# EAGLE design CIRCUITV05 (EAGLE 9.6.2)
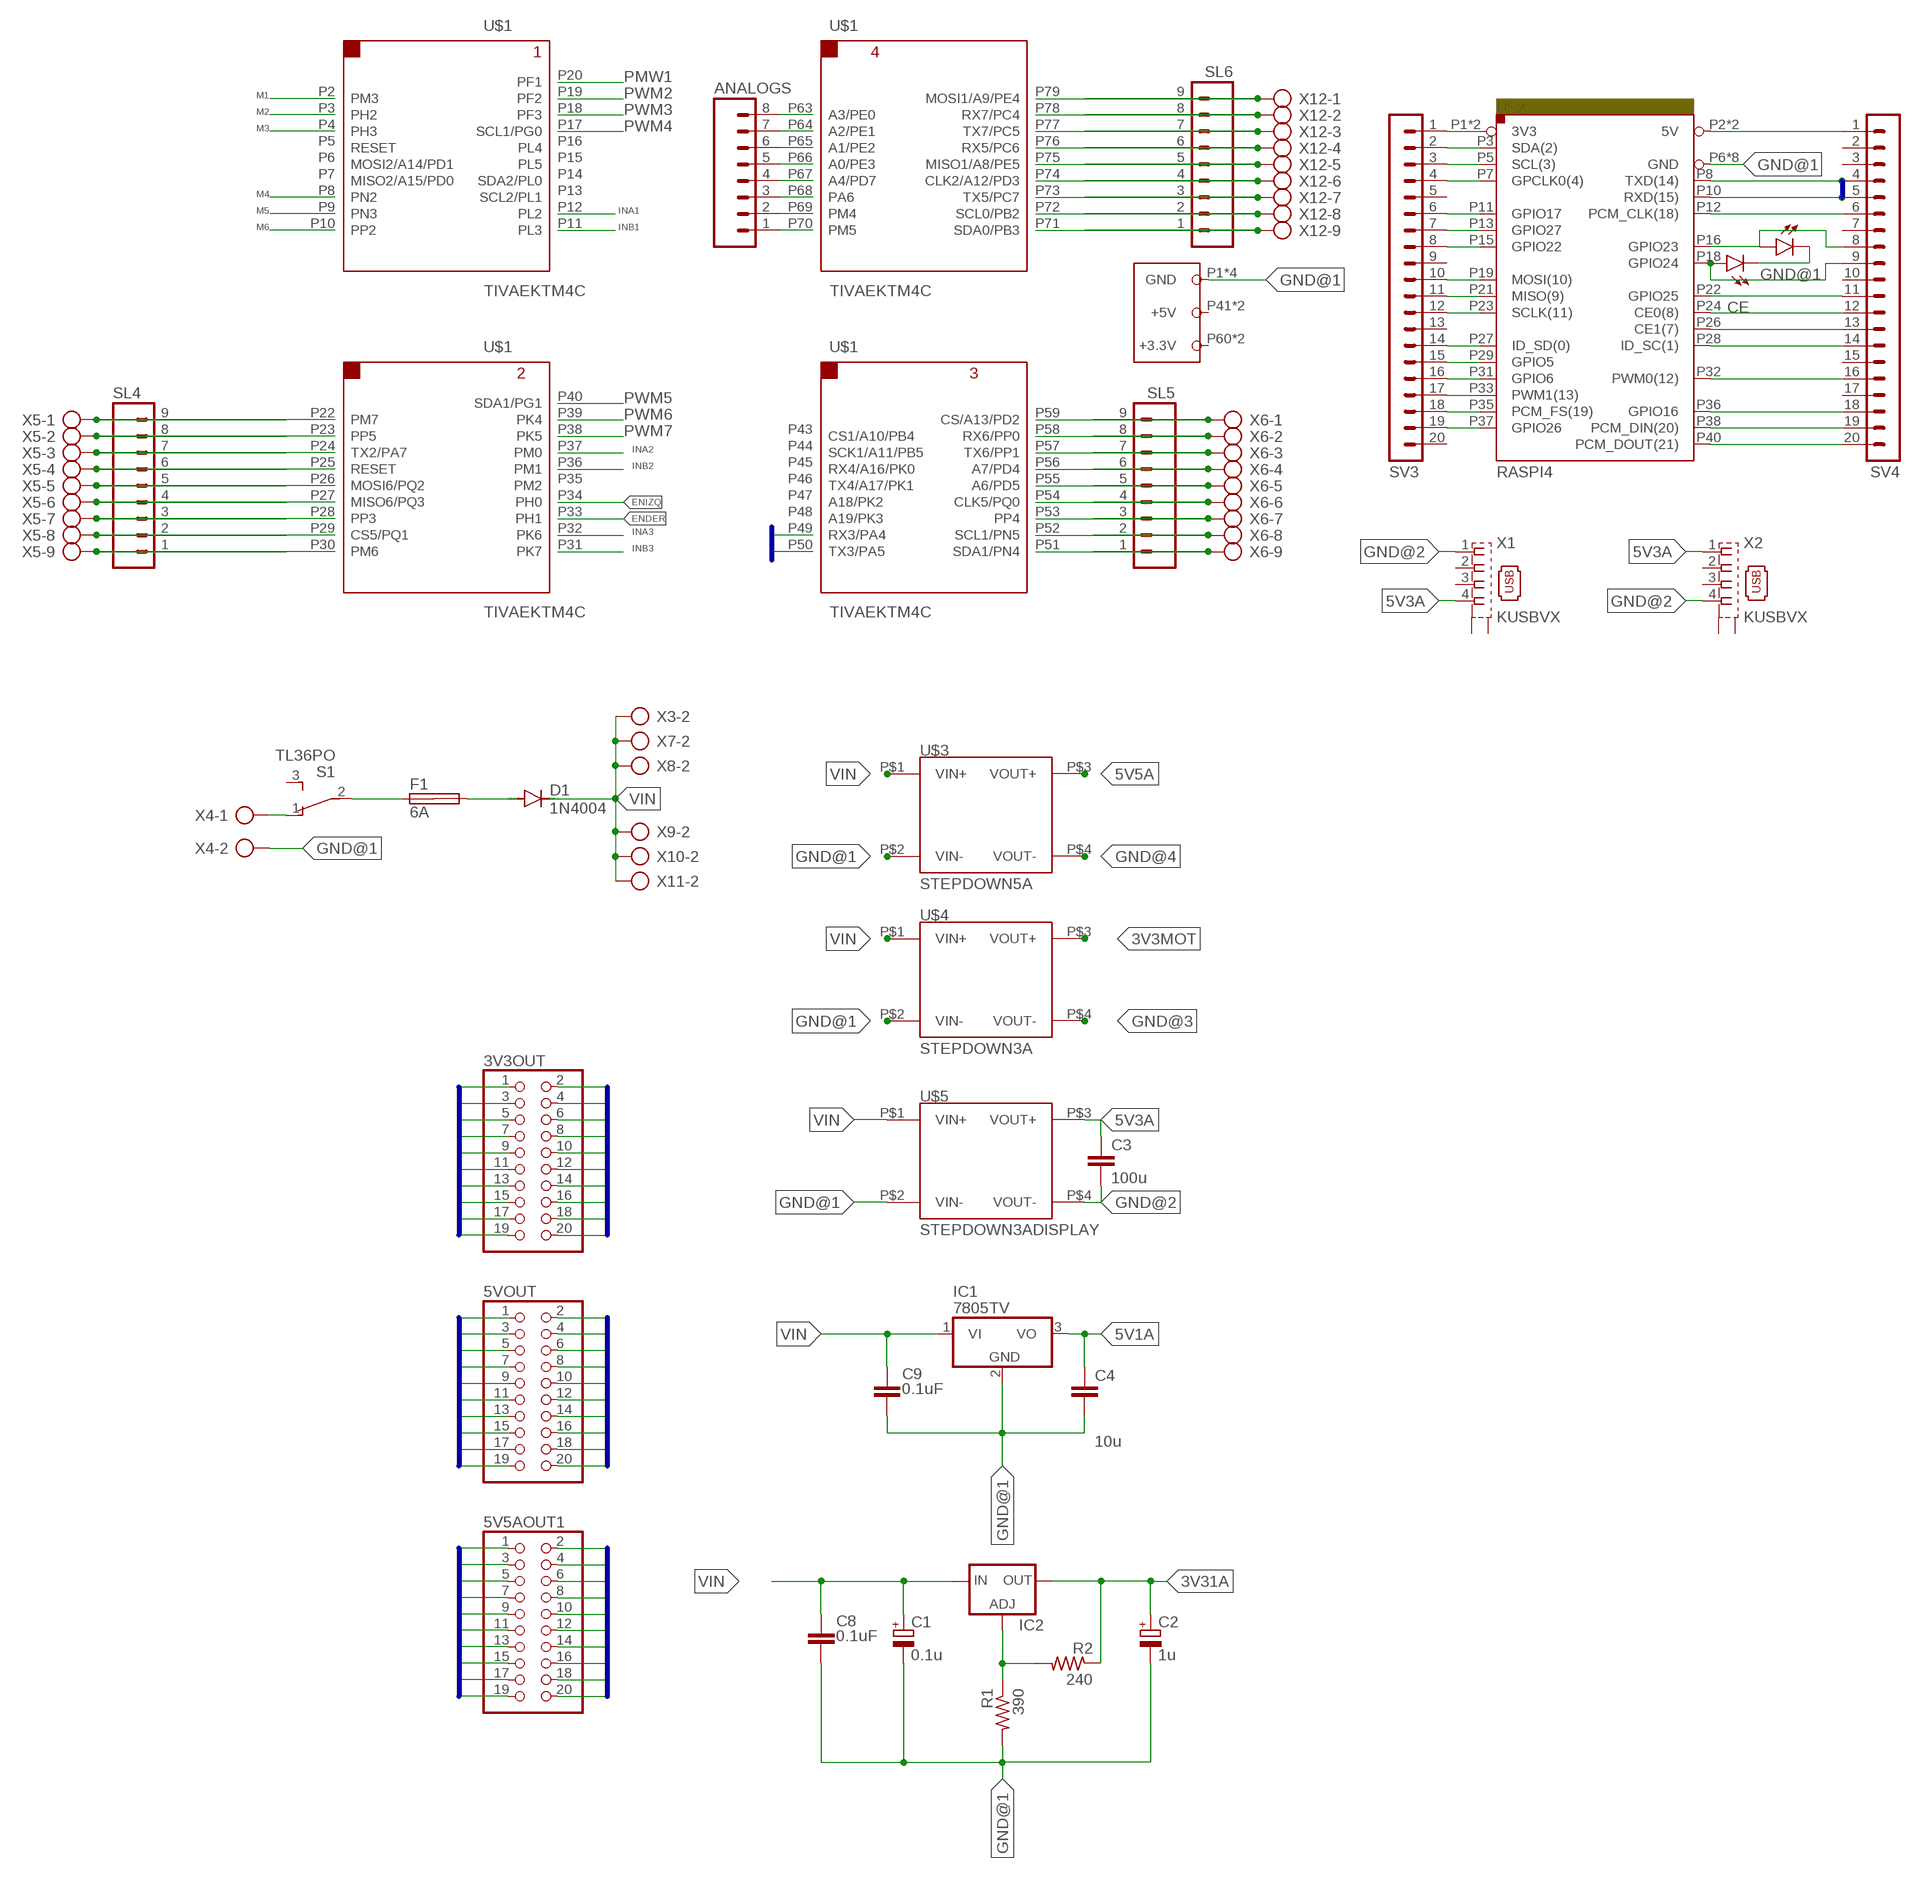
[diagram p0: schematic, sheet 1, part 1 of 2]
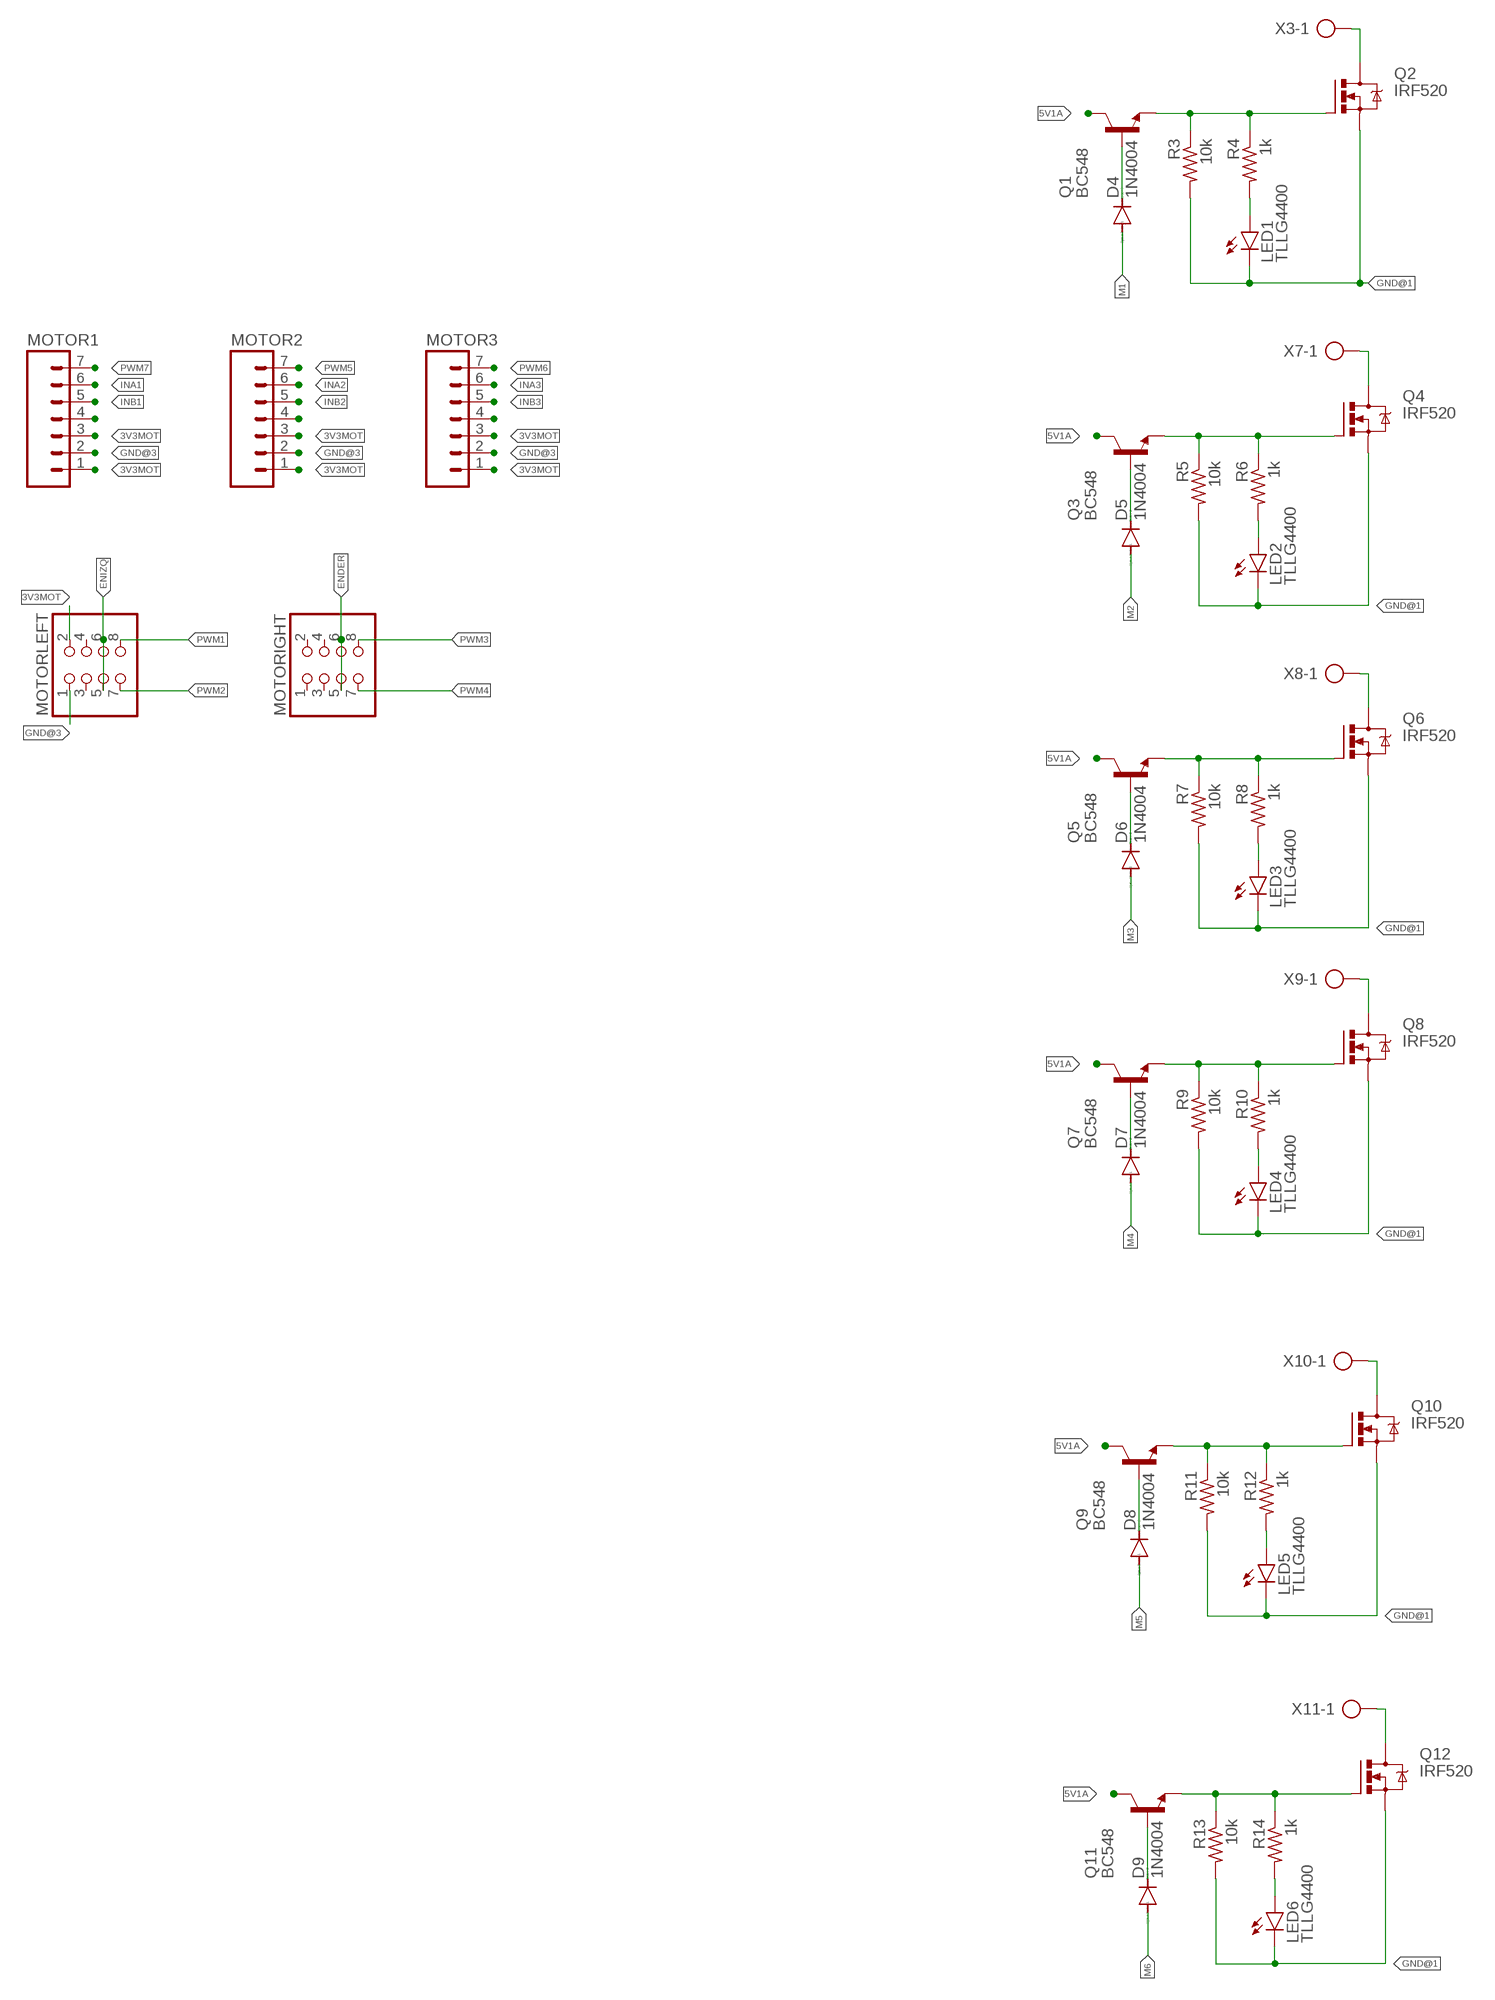
[diagram p1: schematic, sheet 1, part 2 of 2]

## Parts
3V3OUT  PINHD-2X10  [2X10]
5V5AOUT1  PINHD-2X10  [2X10]
5VOUT  PINHD-2X10  [2X10]
ANALOGS  MA08  [08PA]
C1  0.1u  CPOL-EUE5-10.5  [E5-10,5]
C2  1u  CPOL-EUE5-10.5  [E5-10,5]
C3  100u  C-EU025-024X044  [C025-024X044]
C4  10u  C-EU025-024X044  [C025-024X044]
C8  0.1uF  C-EU075-052X106  [C075-052X106]
C9  0.1uF  C-EU075-052X106  [C075-052X106]
D1  1N4004  [DO41-10]
D2  SFH482  [SFH482]
D3  SFH482  [SFH482]
D4  1N4004  [DO41-10]
D5  1N4004  [DO41-10]
D6  1N4004  [DO41-10]
D7  1N4004  [DO41-10]
D8  1N4004  [DO41-10]
D9  1N4004  [DO41-10]
F1  6A  SHK20L  [SHK20L]
IC1  7805TV  [TO220V]
IC2  LM317TL  [317TL]
LED1  TLLG4400  [LED3MM]
LED2  TLLG4400  [LED3MM]
LED3  TLLG4400  [LED3MM]
LED4  TLLG4400  [LED3MM]
LED5  TLLG4400  [LED3MM]
LED6  TLLG4400  [LED3MM]
MOTOR1  MA07  [07PA]
MOTOR2  MA07  [07PA]
MOTOR3  MA07  [07PA]
MOTORIGHT  PINHD-2X4  [2X04]
MOTORLEFT  PINHD-2X4  [2X04]
Q1  BC548  [TO92-EBC]
Q2  IRF520  [TO220BV]
Q3  BC548  [TO92-EBC]
Q4  IRF520  [TO220BV]
Q5  BC548  [TO92-EBC]
Q6  IRF520  [TO220BV]
Q7  BC548  [TO92-EBC]
Q8  IRF520  [TO220BV]
Q9  BC548  [TO92-EBC]
Q10  IRF520  [TO220BV]
Q11  BC548  [TO92-EBC]
Q12  IRF520  [TO220BV]
R1  390  R-US_0207/10  [0207/10]
R2  240  R-US_0207/10  [0207/10]
R3  10k  R-US_0207/10  [0207/10]
R4  1k  R-US_0207/10  [0207/10]
R5  10k  R-US_0207/10  [0207/10]
R6  1k  R-US_0207/10  [0207/10]
R7  10k  R-US_0207/10  [0207/10]
R8  1k  R-US_0207/10  [0207/10]
R9  10k  R-US_0207/10  [0207/10]
R10  1k  R-US_0207/10  [0207/10]
R11  10k  R-US_0207/10  [0207/10]
R12  1k  R-US_0207/10  [0207/10]
R13  10k  R-US_0207/10  [0207/10]
R14  1k  R-US_0207/10  [0207/10]
S1  TL36PO  [TL3XPO]
SL4  M09  [09P]
SL5  M09  [09P]
SL6  M09  [09P]
SV3  MA20-1  [MA20-1]
SV4  MA20-1  [MA20-1]
U$1  TIVAEKTM4C  [TIVAPINESPCB]
U$2  RASPI4  [CONN2-SIL40]
U$3  STEPDOWN5A  [REGULADORSTEP-DOWN5ACURRENT]
U$4  STEPDOWN3A  [REGULADORSTEP-DOWN3A]
U$5  STEPDOWN3ADISPLAY  [REGULADORWITHDISPLAY]
X1  KUSBVX  [KUSBVX]
X2  KUSBVX  [KUSBVX]
X3  AK300/2  [AK300/2]
X4  AK300/2  [AK300/2]
X5  AK300/9  [AK300/9]
X6  AK300/9  [AK300/9]
X7  AK300/2  [AK300/2]
X8  AK300/2  [AK300/2]
X9  AK300/2  [AK300/2]
X10  AK300/2  [AK300/2]
X11  AK300/2  [AK300/2]
X12  AK300/9  [AK300/9]

## Nets
3V3MOT [outsVoltaje]: MOTOR1.1 MOTOR1.3 MOTOR2.1 MOTOR2.3 MOTOR3.1 MOTOR3.3 MOTORLEFT.2 U$4.P$3(VOUT+)
3V31A [outsVoltaje]: 3V3OUT.1 3V3OUT.3 3V3OUT.5 3V3OUT.7 3V3OUT.9 3V3OUT.11 3V3OUT.13 3V3OUT.15 3V3OUT.17 3V3OUT.19 C2.+ IC2.2(OUT) R2.1
5V1A [outsVoltaje]: 5VOUT.1 5VOUT.3 5VOUT.5 5VOUT.7 5VOUT.9 5VOUT.11 5VOUT.13 5VOUT.15 5VOUT.17 5VOUT.19 C4.1 IC1.3(VO) Q1.C Q3.C Q5.C Q7.C Q9.C Q11.C
5V3A [outsVoltaje]: C3.1 U$5.P$3(VOUT+) X1.4 X2.1
5V5A [outsVoltaje]: 5V5AOUT1.1 5V5AOUT1.3 5V5AOUT1.5 5V5AOUT1.7 5V5AOUT1.9 5V5AOUT1.11 5V5AOUT1.13 5V5AOUT1.15 5V5AOUT1.17 5V5AOUT1.19 U$3.P$3(VOUT+)
CE: SV4.12 U$2.P24(CE0(8))
CLK [signals]: SV3.12 U$2.P23(SCLK(11))
ENDER [signals]: MOTORIGHT.5 MOTORIGHT.6 U$1.P33(PH1)
ENIZQ [signals]: MOTORLEFT.5 MOTORLEFT.6 U$1.P34(PH0)
GND@1 [gnds]: 3V3OUT.2 3V3OUT.4 3V3OUT.6 3V3OUT.8 3V3OUT.10 3V3OUT.12 3V3OUT.14 3V3OUT.16 3V3OUT.18 3V3OUT.20 5V5AOUT1.2 5V5AOUT1.4 5V5AOUT1.6 5V5AOUT1.8 5V5AOUT1.10 5V5AOUT1.12 5V5AOUT1.14 5V5AOUT1.16 5V5AOUT1.18 5V5AOUT1.20 5VOUT.2 5VOUT.4 5VOUT.6 5VOUT.8 5VOUT.10 5VOUT.12 5VOUT.14 5VOUT.16 5VOUT.18 5VOUT.20 C4.2 C9.2 D2.K(C) D3.K(C) IC1.2(GND) LED1.K(C) LED2.K(C) LED3.K(C) LED4.K(C) LED5.K(C) LED6.K(C) Q2.S Q4.S Q6.S Q8.S Q10.S Q12.S R3.2 R5.2 R7.2 R9.2 R11.2 R13.2 U$1.P1(GND) U$1.P21(GND) U$1.P42(GND) U$1.P62(GND) U$3.P$2(VIN-) U$4.P$2(VIN-) U$5.P$2(VIN-) X4.2
GND@2 [gnds]: C3.2 U$5.P$4(VOUT-) X1.1 X2.4
GND@3 [gnds]: MOTOR1.2 MOTOR2.2 MOTOR3.2 MOTORLEFT.1 U$4.P$4(VOUT-)
GND@4 [gnds]: U$3.P$4(VOUT-)
INA1 [signals]: MOTOR1.6 U$1.P12(PL2)
INA2 [signals]: MOTOR2.6 U$1.P37(PM0)
INA3 [signals]: MOTOR3.6 U$1.P32(PK6)
INB1 [signals]: MOTOR1.5 U$1.P11(PL3)
INB2 [signals]: MOTOR2.5 U$1.P36(PM1)
INB3 [signals]: MOTOR3.5 U$1.P31(PK7)
M1 [signals]: D4.A U$1.P2(PM3)
M2 [signals]: D5.A U$1.P3(PH2)
M3 [signals]: D6.A U$1.P4(PH3)
M4 [signals]: D7.A U$1.P8(PN2)
M5 [signals]: D8.A U$1.P9(PN3)
M6 [signals]: D9.A U$1.P10(PP2)
MISO [signals]: SV3.10 SV3.11 U$2.P19(MOSI(10)) U$2.P21(MISO(9))
N$1: S1.1(O) X4.1
N$2: F1.1A S1.2(P)
N$3: IC2.1(ADJ) R1.1 R2.2
N$4: SV3.1 U$2.P1(3V3) U$2.P17(3V3)
N$5: C1.- C2.- C8.2 R1.2
N$6: C1.+ C8.1 IC2.3(IN)
N$7: U$2.P6(GND) U$2.P9(GND) U$2.P14(GND) U$2.P20(GND) U$2.P25(GND) U$2.P30(GND) U$2.P34(GND) U$2.P39(GND)
N$8: SV3.2 U$2.P3(SDA(2))
N$9: SV3.3 U$2.P5(SCL(3))
N$10: SV3.4 U$2.P7(GPCLK0(4))
N$11: SV3.6 U$2.P11(GPIO17)
N$12: SV3.7 U$2.P13(GPIO27)
N$13: SV3.8 U$2.P15(GPIO22)
N$14: D1.A F1.2A
N$15: MOTOR2.4
N$16: MOTOR3.4
N$17: SV3.14 U$2.P27(ID_SD(0))
N$18: SV3.15 U$2.P29(GPIO5)
N$19: SV3.16 U$2.P31(GPIO6)
N$20: SV3.17 U$2.P33(PWM1(13))
N$21: SV3.18 U$2.P35(PCM_FS(19))
N$22: SV3.19 U$2.P37(GPIO26)
N$23: SV4.1 U$2.P2(5V) U$2.P4(5V)
N$24: D4.C Q1.B
N$25: MOTOR1.4
N$26: SV4.6 U$2.P12(PCM_CLK(18))
N$27: D3.A SV4.9 U$2.P18(GPIO24)
N$28: Q1.E Q2.G R3.1 R4.1
N$29: SV4.11 U$2.P22(GPIO25)
N$30: LED1.A R4.2
N$31 [signals]: D5.C Q3.B
N$32: SV4.13 U$2.P26(CE1(7))
N$33: SV4.14 U$2.P28(ID_SC(1))
N$34: SV4.16 U$2.P32(PWM0(12))
N$35: SV4.18 U$2.P36(GPIO16)
N$36: SV4.19 U$2.P38(PCM_DIN(20))
N$37: SV4.20 U$2.P40(PCM_DOUT(21))
N$38: D2.A SV4.8 U$2.P16(GPIO23)
N$39: Q2.D X3.1
N$40: SL4.9 U$1.P22(PM7) X5.1
N$41: Q3.E Q4.G R5.1 R6.1
N$42: LED2.A R6.2
N$43 [signals]: Q4.D X7.1
N$44: D6.C Q5.B
N$45: Q5.E Q6.G R7.1 R8.1
N$46: LED3.A R8.2
N$47: Q6.D X8.1
N$48: D7.C Q7.B
N$49: Q7.E Q8.G R9.1 R10.1
N$50: LED4.A R10.2
N$51: Q8.D X9.1
N$52: D8.C Q9.B
N$53: Q9.E Q10.G R11.1 R12.1
N$54: LED5.A R12.2
N$55: Q10.D X10.1
N$56: D9.C Q11.B
N$57: Q11.E Q12.G R13.1 R14.1
N$58: LED6.A R14.2
N$59: Q12.D X11.1
N$60: SL4.8 U$1.P23(PP5) X5.2
N$61: SL4.7 U$1.P24(TX2/PA7) X5.3
N$62: SL4.6 U$1.P25(RESET) X5.4
N$63: SL4.5 U$1.P26(MOSI6/PQ2) X5.5
N$64: SL4.4 U$1.P27(MISO6/PQ3) X5.6
N$65: SL4.3 U$1.P28(PP3) X5.7
N$66: SL4.2 U$1.P29(CS5/PQ1) X5.8
N$67: SL4.1 U$1.P30(PM6) X5.9
N$68: SL5.9 U$1.P59(CS/A13/PD2) X6.1
N$69: SL5.8 U$1.P58(RX6/PP0) X6.2
N$70: SL5.7 U$1.P57(TX6/PP1) X6.3
N$71: SL5.6 U$1.P56(A7/PD4) X6.4
N$72: SL5.5 U$1.P55(A6/PD5) X6.5
N$73: SL5.4 U$1.P54(CLK5/PQ0) X6.6
N$74: SL5.3 U$1.P53(PP4) X6.7
N$75: SL5.2 U$1.P52(SCL1/PN5) X6.8
N$76: SL5.1 U$1.P51(SDA1/PN4) X6.9
N$77: SL6.1 U$1.P71(SDA0/PB3) X12.9
N$78: SL6.2 U$1.P72(SCL0/PB2) X12.8
N$79: SL6.3 U$1.P73(TX5/PC7) X12.7
N$80: SL6.4 U$1.P74(CLK2/A12/PD3) X12.6
N$81: SL6.5 U$1.P75(MISO1/A8/PE5) X12.5
N$82: SL6.6 U$1.P76(RX5/PC6) X12.4
N$83: SL6.7 U$1.P77(TX7/PC5) X12.3
N$84: SL6.8 U$1.P78(RX7/PC4) X12.2
N$85: SL6.9 U$1.P79(MOSI1/A9/PE4) X12.1
N$86: ANALOGS.8 U$1.P63(A3/PE0)
N$87: ANALOGS.7 U$1.P64(A2/PE1)
N$88: ANALOGS.6 U$1.P65(A1/PE2)
N$89: ANALOGS.5 U$1.P66(A0/PE3)
N$90: ANALOGS.4 U$1.P67(A4/PD7)
N$91: ANALOGS.3 U$1.P68(PA6)
N$92: ANALOGS.2 U$1.P69(PM4)
N$93: ANALOGS.1 U$1.P70(PM5)
PMW1 [signals]: U$1.P20(PF1)
PWM1: MOTORLEFT.8
PWM2 [signals]: MOTORLEFT.7 U$1.P19(PF2)
PWM3 [signals]: MOTORIGHT.8 U$1.P18(PF3)
PWM4 [signals]: MOTORIGHT.7 U$1.P17(SCL1/PG0)
PWM5 [signals]: MOTOR2.7 U$1.P40(SDA1/PG1)
PWM6 [signals]: MOTOR3.7 U$1.P39(PK4)
PWM7: MOTOR1.7 U$1.P38(PK5)
RX [signals]: SV4.5 U$2.P10(RXD(15))
RX3 [signals]: U$1.P49(RX3/PA4)
TX [signals]: SV4.4 U$2.P8(TXD(14))
TX3 [signals]: U$1.P50(TX3/PA5)
VIN [VInbat]: C9.1 D1.C IC1.1(VI) U$3.P$1(VIN+) U$4.P$1(VIN+) U$5.P$1(VIN+) X3.2 X7.2 X8.2 X9.2 X10.2 X11.2
Unconnected: F1.1B F1.2B MOTORIGHT.1 MOTORIGHT.2 MOTORIGHT.3 MOTORIGHT.4 MOTORLEFT.3 MOTORLEFT.4 S1.3(S) SV3.5 SV3.9 SV3.13 SV3.20 SV4.2 SV4.3 SV4.7 SV4.10 SV4.15 SV4.17 U$1.P5(RESET) U$1.P6(MOSI2/A14/PD1) U$1.P7(MISO2/A15/PD0) U$1.P13(SCL2/PL1) U$1.P14(SDA2/PL0) U$1.P15(PL5) U$1.P16(PL4) U$1.P35(PM2) U$1.P41(+5V) U$1.P43(CS1/A10/PB4) U$1.P44(SCK1/A11/PB5) U$1.P45(RX4/A16/PK0) U$1.P46(TX4/A17/PK1) U$1.P47(A18/PK2) U$1.P48(A19/PK3) U$1.P60(+3.3V) U$1.P61(+5V) U$1.P80(+3.3V) X1.2 X1.3 X1.M1(S1) X1.M2(S2) X2.2 X2.3 X2.M1(S1) X2.M2(S2)

## Buses
5V1A:5V1A
GNDS:GND@1
3V31AS:3V31A
UARTIVA:RX3,TX3
UARTRASP:RX,TX
5V5A

## Library data of the parts
3V3OUT 5V5AOUT1 5VOUT = pinhead:PINHD-2X10: PIN HEADER
ANALOGS = con-amp-quick:MA08: AMP QUICK CONNECTOR; OC_FARNELL: unknown; OC_NEWARK: unknown
C1 C2 = rcl:CPOL-EU: POLARIZED CAPACITOR, European symbol; SPICEPREFIX: C
C3 C4 C8 C9 = rcl:C-EU: CAPACITOR, European symbol; SPICEPREFIX: C
D1 D4-D9 = diode:1N4004: DIODE general purpose rectifier, 1 A
D2 D3 = led:SFH482: IR LED infrared emitting diode, Infineon
F1 = fuse:SHK20L: FUSE HOLDER 5 x 20 mm, SH contact, SHH1 Schukat, E1073 Buerklin; OC_FARNELL: unknown; OC_NEWARK: unknown
IC1 = linear:78*: Positive VOLTAGE REGULATOR Source: http://cache.national.com/ds/LM/LM78L05.pdf http://www.fairchildsemi.com/ds/LM/LM7805.pdf
IC2 = v-reg:LM317TL: VOLTAGE REGULATOR
LED1-LED6 = led:TLLG4400: Low Current (2mA) LED 3 mm Tinted Diffused Package color GREEN Source: Data sheet <http://www.farnell.com/datasheets/391098.pdf>; MF: VISHAY SEMICONDUCTOR; OC_FARNELL: 1612435
MOTOR1-MOTOR3 = con-amp-quick:MA07: AMP QUICK CONNECTOR; OC_FARNELL: unknown; OC_NEWARK: unknown
MOTORIGHT MOTORLEFT = pinhead:PINHD-2X4: PIN HEADER
Q1 Q3 Q5 Q7 Q9 Q11 = transistor-npn:BC548*: NPN Transistor
Q2 Q4 Q6 Q8 Q10 Q12 = transistor-power:IRF520: HEXFET Power MOSFET
R1-R14 = rcl:R-US_: RESISTOR, American symbol; SPICEPREFIX: R
S1 = switch:TL36PO: TINY SWITCH ON - ON Source: http://www2.produktinfo.conrad.com/datenblaetter/700000-724999/705152-da-01-de-Subminiaturschalter_TL_36YO.pdf
SL4-SL6 = con-amp-quick:M09: AMP QUICK CONNECTOR; OC_FARNELL: unknown; OC_NEWARK: unknown
SV3 SV4 = con-lstb:MA20-1: PIN HEADER; OC_FARNELL: unknown; OC_NEWARK: unknown
U$1 = TivaConnector:TIVAEKTM4C
U$2 = RaspConnector:RASPI4
U$3 = ReguladoresStep:STEPDOWN5A
U$4 = ReguladoresStep:STEPDOWN3A
U$5 = ReguladoresStep:STEPDOWN3ADISPLAY
X1 X2 = con-kycon:KUSBVX: Vertical,Top Entry Universal Serial Bus Connector KUSBVX Series Source: KYCON Sibalco USB vertical socket KUSBV.pdf
X3 X4 X7-X11 = con-ptr500:AK300/2: CONNECTOR; OC_FARNELL: unknown; OC_NEWARK: unknown
X5 X6 X12 = con-ptr500:AK300/9: CONNECTOR; OC_FARNELL: unknown; OC_NEWARK: unknown

## Net classes
0 default: width 1.016 mm, drill 2.032 mm, clearance 0.508 mm
3 VInbat: width 2.032 mm, drill 2.032 mm, clearance 0.508 mm
5 outsVoltaje: width 1.524 mm, drill 2.032 mm, clearance 0.508 mm
6 signals: width 1.016 mm, drill 2.032 mm, clearance 0.508 mm
7 gnds: width 0.762 mm, drill 2.032 mm, clearance 0.508 mm

## Board
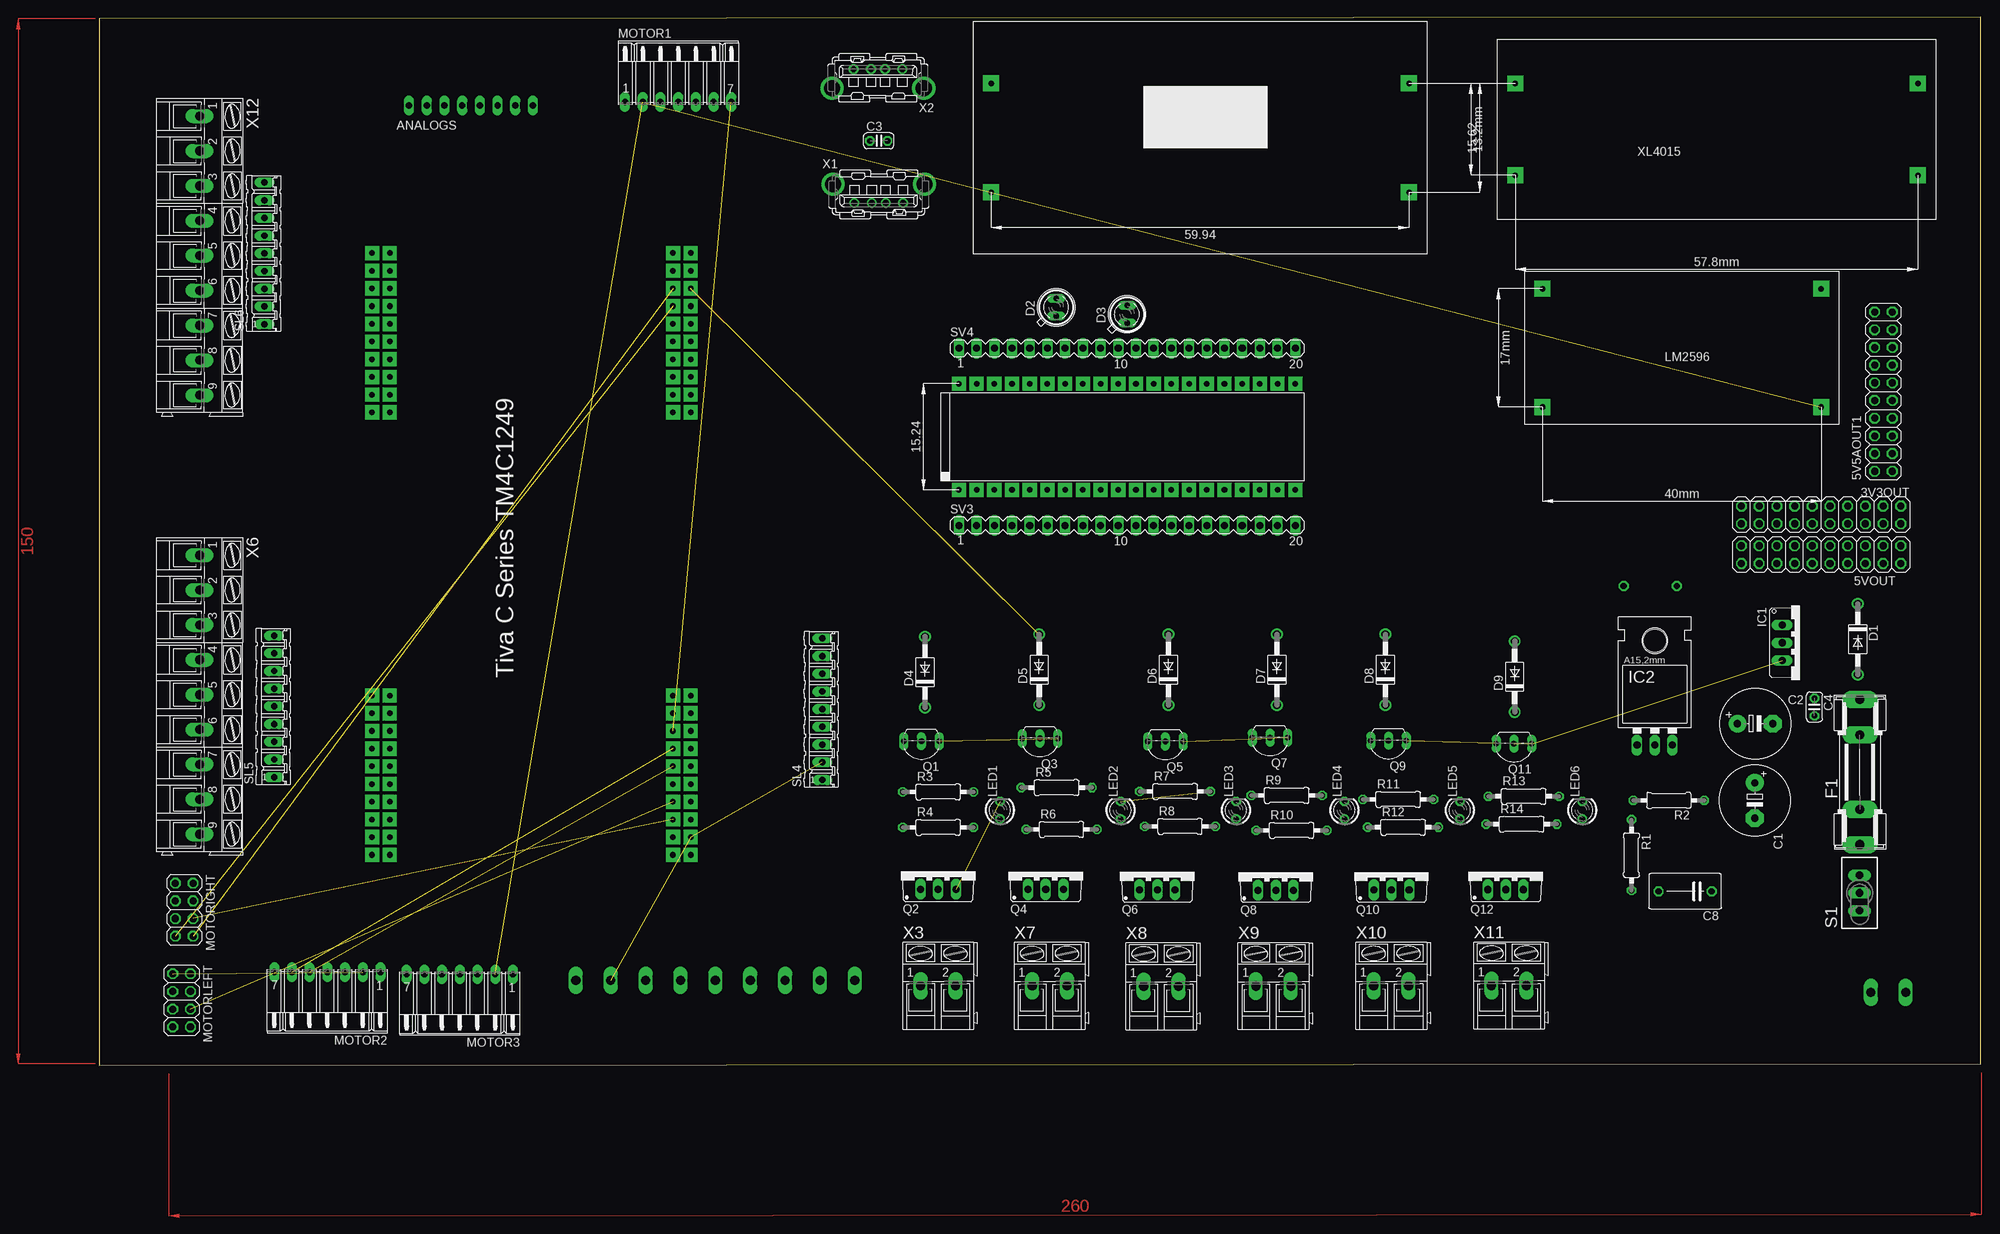
[diagram p2: board, top side]
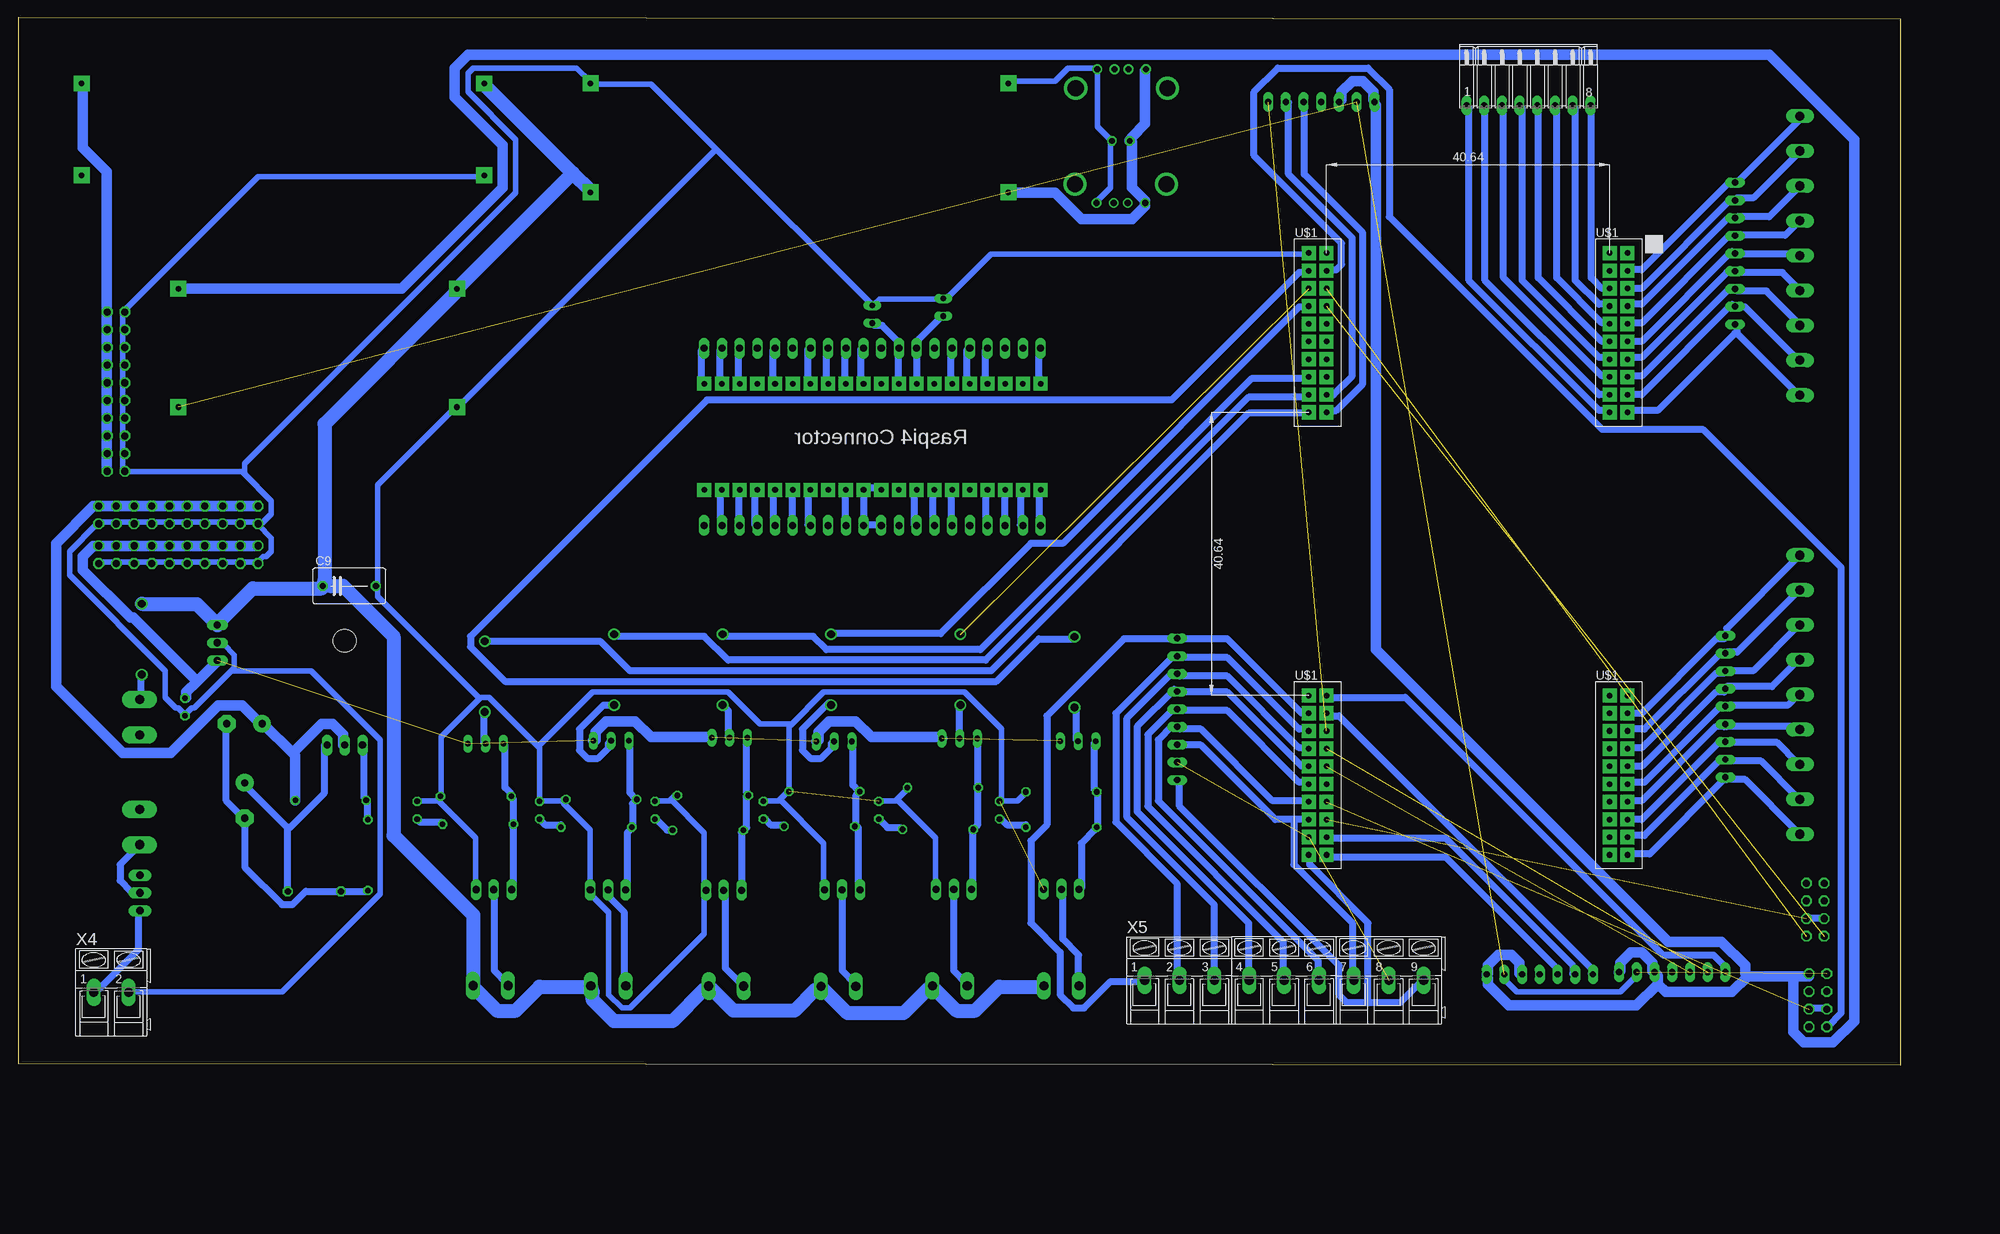
[diagram p3: board, bottom side, seen from below]

Size 269.98 x 150.34 mm. Coordinates in mm from the lower left corner, seen from the top.
Outline: 0,0 269.98,0.2 269.98,150.34 0,150.14 0,0
Copper layers (1*16): Top 0.035mm / dielectric 1.5mm / Bottom 0.035mm
Design rules "default": minimum track width 6mil, minimum drill 0.35mm, track to track 6mil, track to pad 6mil, pad to pad 6mil, via to via 6mil, smd to smd 6mil, copper to edge 40mil, drill to drill 6mil, minimum pad ring 10mil, minimum via ring 8mil, stop-mask expansion 4mil, vias tented up to drill 0mil, thermal gap 10mil

### Footprints (pad centres in the part's own frame; a part is rotated, then mirrored left to right if it is on the bottom)
2X10 = drill 1.016 octagon: 1 -11.43,-1.27; 2 -11.43,1.27; 3 -8.89,-1.27; 4 -8.89,1.27; 5 -6.35,-1.27; 6 -6.35,1.27; 7 -3.81,-1.27; 8 -3.81,1.27; 9 -1.27,-1.27; 10 -1.27,1.27; 11 1.27,-1.27; 12 1.27,1.27; 13 3.81,-1.27; 14 3.81,1.27; 15 6.35,-1.27; 16 6.35,1.27; 17 8.89,-1.27; 18 8.89,1.27; 19 11.43,-1.27; 20 11.43,1.27
08PA = drill 0.914 long: 1 -8.89,0; 2 -6.35,0; 3 -3.81,0; 4 -1.27,0; 5 1.27,0; 6 3.81,0; 7 6.35,0; 8 8.89,0
E5-10,5 = drill 1.016 pad 2.54: + -2.54,0 | drill 1.016 pad 2.54 octagon: - 2.54,0
C025-024X044 = drill 0.813 octagon: 1 -1.27,0; 2 1.27,0
C075-052X106 = drill 0.914 octagon: 1 -3.81,0; 2 3.81,0
DO41-10 = drill 1.118: A 5.08,0; C -5.08,0
SFH482 = drill 0.813 long: A -1.27,0; K 1.27,0
SHK20L = drill 1.321 pad 2.54 long: 1A -10.414,0; 1B -5.334,0; 2A 10.414,0; 2B 5.334,0
TO220V = drill 1.016 long: 1 -2.54,-2.54; 2 0,-2.54; 3 2.54,-2.54
317TL = drill 1.016 long: 1 -2.54,-3.81; 2 0,-3.81; 3 2.54,-3.81 | hole 3.302: 0,11.176
LED3MM = drill 0.813 octagon: A -1.27,0; K 1.27,0
07PA = drill 0.914 long: 1 -7.62,0; 2 -5.08,0; 3 -2.54,0; 4 0,0; 5 2.54,0; 6 5.08,0; 7 7.62,0
2X04 = drill 1.016 octagon: 1 -3.81,-1.27; 2 -3.81,1.27; 3 -1.27,-1.27; 4 -1.27,1.27; 5 1.27,-1.27; 6 1.27,1.27; 7 3.81,-1.27; 8 3.81,1.27
TO92-EBC = drill 0.813 long: B 0,-1.27; C -2.54,-1.27; E 2.54,-1.27
TO220BV = drill 1.016 long: D 0,-2.54; G -2.54,-2.54; S 2.54,-2.54
0207/10 = drill 0.813 octagon: 1 -5.08,0; 2 5.08,0
TL3XPO = drill 1.1 pad 1.422 long: 1 -2.54,0; 2 0,0; 3 2.54,0
09P = drill 0.914 long: 1 -10.16,0; 2 -7.62,0; 3 -5.08,0; 4 -2.54,0; 5 0,0; 6 2.54,0; 7 5.08,0; 8 7.62,0; 9 10.16,0
MA20-1 = drill 1.016 long: 1 -24.13,0; 2 -21.59,0; 3 -19.05,0; 4 -16.51,0; 5 -13.97,0; 6 -11.43,0; 7 -8.89,0; 8 -6.35,0; 9 -3.81,0; 10 -1.27,0; 11 1.27,0; 12 3.81,0; 13 6.35,0; 14 8.89,0; 15 11.43,0; 16 13.97,0; 17 16.51,0; 18 19.05,0; 19 21.59,0; 20 24.13,0
TIVAPINESPCB = drill 0.8 pad 2.032 square: P1 -1.27,11.43; P2 -1.27,8.89; P3 -1.27,6.35; P4 -1.27,3.81; P5 -1.27,1.27; P6 -1.27,-1.27; P7 -1.27,-3.81; P8 -1.27,-6.35; P9 -1.27,-8.89; P10 -1.27,-11.43; P11 1.27,-11.43; P12 1.27,-8.89; P13 1.27,-6.35; P14 1.27,-3.81; P15 1.27,-1.27; P16 1.27,1.27; P17 1.27,3.81; P18 1.27,6.35; P19 1.27,8.89; P20 1.27,11.43; P21 -1.27,-52.07; P22 -1.27,-54.61; P23 -1.27,-57.15; P24 -1.27,-59.69; P25 -1.27,-62.23; P26 -1.27,-64.77; P27 -1.27,-67.31; P28 -1.27,-69.85; P29 -1.27,-72.39; P30 -1.27,-74.93; P31 1.27,-74.93; P32 1.27,-72.39; P33 1.27,-69.85; P34 1.27,-67.31; P35 1.27,-64.77; P36 1.27,-62.23; P37 1.27,-59.69; P38 1.27,-57.15; P39 1.27,-54.61; P40 1.27,-52.07; P41 41.91,-52.07; P42 41.91,-54.61; P43 41.91,-57.15; P44 41.91,-59.69; P45 41.91,-62.23; P46 41.91,-64.77; P47 41.91,-67.31; P48 41.91,-69.85; P49 41.91,-72.39; P50 41.91,-74.93; P51 44.45,-74.93; P52 44.45,-72.39; P53 44.45,-69.85; P54 44.45,-67.31; P55 44.45,-64.77; P56 44.45,-62.23; P57 44.45,-59.69; P58 44.45,-57.15; P59 44.45,-54.61; P60 44.45,-52.07; P61 41.91,11.43; P62 41.91,8.89; P63 41.91,6.35; P64 41.91,3.81; P65 41.91,1.27; P66 41.91,-1.27; P67 41.91,-3.81; P68 41.91,-6.35; P69 41.91,-8.89; P70 41.91,-11.43; P71 44.45,-11.43; P72 44.45,-8.89; P73 44.45,-6.35; P74 44.45,-3.81; P75 44.45,-1.27; P76 44.45,1.27; P77 44.45,3.81; P78 44.45,6.35; P79 44.45,8.89; P80 44.45,11.43
CONN2-SIL40 = drill 0.8 pad 2.032 square: P1 -7.62,0; P2 7.62,0; P3 -7.62,-2.54; P4 7.62,-2.54; P5 -7.62,-5.08; P6 7.62,-5.08; P7 -7.62,-7.62; P8 7.62,-7.62; P9 -7.62,-10.16; P10 7.62,-10.16; P11 -7.62,-12.7; P12 7.62,-12.7; P13 -7.62,-15.24; P14 7.62,-15.24; P15 -7.62,-17.78; P16 7.62,-17.78; P17 -7.62,-20.32; P18 7.62,-20.32; P19 -7.62,-22.86; P20 7.62,-22.86; P21 -7.62,-25.4; P22 7.62,-25.4; P23 -7.62,-27.94; P24 7.62,-27.94; P25 -7.62,-30.48; P26 7.62,-30.48; P27 -7.62,-33.02; P28 7.62,-33.02; P29 -7.62,-35.56; P30 7.62,-35.56; P31 -7.62,-38.1; P32 7.62,-38.1; P33 -7.62,-40.64; P34 7.62,-40.64; P35 -7.62,-43.18; P36 7.62,-43.18; P37 -7.62,-45.72; P38 7.62,-45.72; P39 -7.62,-48.26; P40 7.62,-48.26
REGULADORSTEP-DOWN5ACURRENT = drill 0.8 pad 2.286 square: P$1 0,-3.81; P$2 0,-16.98; P$3 57.77,-3.81; P$4 57.77,-16.98
REGULADORSTEP-DOWN3A = drill 0.8 pad 2.286 square: P$1 0,0; P$2 0,-16.98; P$3 39.99,0; P$4 39.99,-16.98
REGULADORWITHDISPLAY = drill 0.8 pad 2.286 square: P$1 0,0; P$2 0,-15.621; P$3 59.944,0; P$4 59.944,-15.621
KUSBVX = drill 0.9 pad 1.3: 1 3.5,0; 2 1,0; 3 -1,0; 4 -3.5,0 | drill 2.3 pad 2.8: M1 -6.57,2.71; M2 6.57,2.71
AK300/2 = drill 1.321 long: 1 -2.515,0; 2 2.489,0
AK300/9 = drill 1.321 long: 1 -20.015,0; 2 -15.011,0; 3 -10.008,0; 4 -5.004,0; 5 0,0; 6 5.004,0; 7 10.008,0; 8 15.011,0; 9 20.015,0

### Placement (x,y rotation side)
3V3OUT  247.06,78.95 180 top
5V5AOUT1  256,96.64 90 top
5VOUT  247.06,73.25 180 top
ANALOGS  53.36,137.7 0 bottom
C1  237.55,37.98 270 top
C2  237.59,49 0 top
C3  111.85,132.63 0 top
C4  246.1,51.39 270 top
C8  227.55,24.94 180 top
C9  222.55,68.76 0 bottom
D1  252.31,61.12 270 top
D2  137.32,108.75 90 top
D3  147.48,107.75 90 top
D4  118.49,56.4 90 top
D5  134.86,56.75 90 top
D6  153.42,56.75 90 top
D7  168.98,56.75 90 top
D8  184.54,56.75 90 top
D9  203.1,55.75 90 top
F1  252.62,42.04 90 top
IC1  244.01,60.61 270 top
IC2  223.19,49.73 0 top
LED1  129.25,36.59 90 top
LED2  146.56,36.59 90 top
LED3  163.12,36.59 90 top
LED4  178.68,36.59 90 top
LED5  195.24,36.59 90 top
LED6  212.8,36.59 90 top
MOTOR1  83.08,138.2 0 top
MOTOR2  32.74,13.33 180 top
MOTOR3  51.74,13.03 180 top
MOTORIGHT  12.21,22.3 270 top
MOTORLEFT  11.83,9.3 270 top
Q1  117.98,45.22 180 top
Q2  120.38,27.78 0 top
Q3  134.98,45.61 180 top
Q4  135.81,27.76 0 top
Q5  152.98,45.17 180 top
Q6  151.81,27.7 0 top
Q7  167.98,45.73 180 top
Q8  168.81,27.64 0 top
Q9  184.98,45.29 180 top
Q10  185.41,27.68 0 top
Q11  202.98,44.85 180 top
Q12  201.81,27.72 0 top
R1  219.85,30.14 270 top
R2  225.2,38 180 top
R3  120.38,39.21 0 top
R4  120.38,34.13 0 top
R5  137.38,39.82 0 top
R6  138.08,33.82 0 top
R7  154.38,39.26 0 top
R8  155.08,34.26 0 top
R9  170.38,38.7 0 top
R10  171.08,33.7 0 top
R11  186.38,38.14 0 top
R12  187.08,34.14 0 top
R13  204.38,38.58 0 top
R14  204.08,34.58 0 top
S1  252.58,24.71 90 top
SL4  103.73,51.08 90 top
SL5  25.11,51.48 90 top
SL6  23.73,116.48 90 top
SV3  147.48,77.46 0 top
SV4  147.48,102.86 0 top
U$1  83.6,105.1 0 bottom
U$2  123.35,90.16 90 top
U$3  203.16,144.67 0 top
U$4  207.08,111.41 0 top
U$5  187.93,125.25 180 top
X1  111.85,123.71 0 top
X2  111.74,142.91 180 top
X3  120.38,11.38 0 top
X4  256.67,10.44 0 bottom
X5  88.41,12.16 0 bottom
X6  14.41,53.16 270 top
X7  136.38,11.37 0 top
X8  152.38,11.31 0 top
X9  168.48,11.35 0 top
X10  185.38,11.39 0 top
X11  202.28,11.43 0 top
X12  14.41,116.16 270 top

### Tracks (layer width: path | path; a pad name or v marks a point on that pad's centre or on a via)
3V3MOT
  Bottom 1.524: MOTOR1.3 80.17,138.5 80.17,139.65 78.64,141.17 77.12,141.17 75.6,139.65 75.6,138.5 MOTOR1.1 75.22,137.74 75.22,59.64 33.3,17.73 25.69,17.73 22.26,14.3 22.26,13.15 21.88,12.77 | MOTOR3.3 54.64,13.15 54.64,14.68 55.78,15.82 57.69,15.82 59.21,14.3 59.21,13.15 MOTOR3.1 59.21,12.39 59.21,11.63 56.16,8.58 37.88,8.58 34.83,11.63 | MOTOR2.1 40.16,13.53 40.16,14.68 38.64,16.2 37.11,16.2 35.59,14.68 35.59,13.53 MOTOR2.3 34.83,12.77 34.83,11.63 | 21.88,12.77 15.4,12.77 | 15.4,12.77 13.11,12.77 MOTORLEFT.2 | 21.88,12.77 24.16,10.49 33.69,10.49 34.83,11.63 | 15.4,12.77 15.4,4.77 13.87,3.25 9.68,3.25 6.63,6.3 6.63,132.79 18.83,144.98 205.52,144.98 207.42,143.07 207.42,138.88 200.56,132.03 200.56,125.93 215.04,111.45 247.05,111.45 U$4.P$3
3V31A
  Bottom 1.524: 3V3OUT.19 236,80.21 237.9,80.21 3V3OUT.17 238.66,80.21 240.57,80.21 3V3OUT.15 241.33,80.21 242.85,80.21 3V3OUT.13 243.62,80.21 245.52,80.21 3V3OUT.11 246.28,80.21 248.19,80.21 3V3OUT.9 248.95,80.21 250.47,80.21 3V3OUT.7 251.24,80.21 253.14,80.21 3V3OUT.5 253.9,80.21 255.81,80.21 3V3OUT.3 256.57,80.21 258.48,80.21 3V3OUT.1 259.24,80.21 264.57,74.88 264.57,54.3 255.05,44.78 248.19,44.78 241.33,51.63 237.9,51.63 235.62,49.35 C2.+ 234.85,48.97 230.66,44.78 | 230.66,44.78 230.28,44.4 230.28,38.3 R2.1 | 230.66,44.78 226.47,48.97 224.95,48.97 223.42,47.44 223.42,45.92 IC2.2
5V1A  (4 unrouted)
  Bottom 1.524: 244.38,55.06 241.71,57.73 IC1.3 | 244.38,55.06 245.9,53.54 245.9,52.78 C4.1 | 5VOUT.19 236,74.5 237.9,74.5 5VOUT.17 238.66,74.5 240.57,74.5 5VOUT.15 241.33,74.5 242.85,74.5 5VOUT.13 243.62,74.5 245.52,74.5 5VOUT.11 246.28,74.5 248.19,74.5 5VOUT.9 248.95,74.5 250.47,74.5 5VOUT.7 251.24,74.5 253.14,74.5 5VOUT.5 253.9,74.5 255.81,74.5 5VOUT.3 256.57,74.5 258.48,74.5 5VOUT.1 259.24,74.5 260.76,72.97 260.76,71.07 253.9,64.21 253.52,64.21 244.38,55.06 | Q3.C 137.7,47.06 147.6,47.06 149.89,49.35 153.7,49.35 155.22,47.82 155.22,46.68 Q5.C | Q7.C 170.85,47.06 179.23,47.06 181.51,49.35 185.7,49.35 187.23,47.82 187.23,46.68 Q9.C
5V3A
  Bottom 1.524: X2.1 108.36,142.69 108.36,135.07 110.27,133.17 C3.1 110.27,132.41 110.27,125.93 108.36,124.03 X1.4 108.36,123.26 110.27,121.36 117.51,121.36 121.32,125.17 127.79,125.17 U$5.P$3
5V5A
  Bottom 1.524: 5V5AOUT1.1 257.33,85.54 257.33,87.45 5V5AOUT1.3 257.33,88.21 257.33,90.12 5V5AOUT1.5 257.33,90.88 257.33,92.78 5V5AOUT1.7 257.33,93.54 257.33,95.07 5V5AOUT1.9 257.33,95.83 257.33,97.74 5V5AOUT1.11 257.33,98.5 257.33,100.4 5V5AOUT1.13 257.33,101.16 257.33,102.69 5V5AOUT1.15 257.33,103.45 257.33,105.36 5V5AOUT1.17 257.33,106.12 257.33,108.02 5V5AOUT1.19 257.33,108.78 257.33,128.22 260.76,131.64 260.76,140.79 U$3.P$3
CE
  Bottom 1.016: SV4.12 151.41,102.69 151.41,98.12 U$2.P24
CLK
  Bottom 1.016: SV3.12 151.41,77.54 151.41,82.5 U$2.P23
ENDER  (1 unrouted)
  Bottom 1.016: MOTORIGHT.5 11.21,21.15 13.11,21.15 MOTORIGHT.6
ENIZQ  (1 unrouted)
  Bottom 1.016: MOTORLEFT.5 10.83,8.2 12.73,8.2 MOTORLEFT.6
GND@1  (2 unrouted)
  Bottom 0.762: 239.24,56.78 239.05,56.97 239.05,58.87 240.57,60.4 241.33,60.4 IC1.2 | 239.24,56.78 244.76,51.25 245.14,51.25 245.9,50.49 C4.2 246.28,50.49 247.05,51.25 247.43,51.25 248.95,52.78 248.95,56.59 262.67,70.3 262.67,73.73 258.86,77.54 3V3OUT.2 258.48,77.92 256.19,77.92 3V3OUT.4 255.81,77.92 253.52,77.92 3V3OUT.6 253.14,77.92 251.24,77.92 3V3OUT.8 250.86,77.92 248.57,77.92 3V3OUT.10 248.19,77.92 245.9,77.92 3V3OUT.12 245.52,77.92 243.62,77.92 3V3OUT.14 243.24,77.92 240.95,77.92 3V3OUT.16 240.57,77.92 238.28,77.92 3V3OUT.18 237.9,77.92 236,77.92 3V3OUT.20 | X4.2 253.9,10.49 232.19,10.49 218.09,24.58 218.09,46.68 228,56.59 239.05,56.59 239.24,56.78 | 5VOUT.2 258.48,72.21 256.19,72.21 5VOUT.4 255.81,72.21 253.52,72.21 5VOUT.6 253.14,72.21 251.24,72.21 5VOUT.8 250.86,72.21 248.57,72.21 5VOUT.10 248.19,72.21 245.9,72.21 5VOUT.12 245.52,72.21 243.62,72.21 5VOUT.14 243.24,72.21 240.95,72.21 5VOUT.16 240.57,72.21 238.28,72.21 5VOUT.18 237.9,72.21 236,72.21 5VOUT.20 235.62,72.21 234.85,72.97 234.47,72.97 233.71,73.73 233.71,75.64 235.62,77.54 3V3OUT.20 | U$3.P$2 203.23,127.45 235.62,127.45 254.67,108.4 5V5AOUT1.20 255.05,108.02 255.05,105.74 5V5AOUT1.18 255.05,105.36 255.05,103.07 5V5AOUT1.16 255.05,102.69 255.05,100.78 5V5AOUT1.14 255.05,100.4 255.05,98.12 5V5AOUT1.12 255.05,97.74 255.05,95.45 5V5AOUT1.10 255.05,95.07 255.05,93.16 5V5AOUT1.8 255.05,92.78 255.05,90.5 5V5AOUT1.6 255.05,90.12 255.05,87.83 5V5AOUT1.4 255.05,87.45 255.05,85.54 5V5AOUT1.2 254.67,85.16 237.9,85.16 237.71,84.97 | 237.71,84.97 233.71,80.97 233.71,79.07 235.24,77.54 3V3OUT.20
  Bottom 0.762: 169.89,131.45 147.6,109.17 D3.K 147.22,109.17 146.46,109.93 137.7,109.93 D2.K 136.94,109.93 130.46,116.41 85.12,116.41 U$1.P1 | 169.89,131.45 179.23,140.79 187.61,140.79 U$5.P$2 187.99,141.17 189.9,143.07 204.75,143.07 205.52,142.31 205.52,139.65 198.66,132.79 198.66,125.17 237.52,86.31 237.52,85.16 237.71,84.97 | R3.2 125.51,39.06 126.65,37.92 128.94,37.92 LED1.K 128.94,38.3 128.94,48.21 134.27,53.54 154.46,53.54 159.23,48.78 | 160.75,38.11 159.8,39.06 R7.2 159.42,39.44 159.42,48.59 159.23,48.78 | 160.75,38.11 160.94,37.92 162.84,37.92 LED3.K | 160.75,38.11 154.46,31.82 154.46,25.35 Q6.S | 176.37,38.11 175.8,38.68 R9.2 | 176.37,38.11 176.56,37.92 178.47,37.92 LED4.K | 176.37,38.11 171.61,33.35 171.61,25.35 Q8.S 171.61,24.96 171.61,18.87 182.28,8.2 183.42,8.2 185.32,10.11 185.32,21.92 187.61,24.2 187.61,24.96 Q10.S 187.99,25.35 187.99,33.73 191.8,37.54 191.8,37.92 | 191.8,37.92 195.23,37.92 LED5.K 195.23,38.3 195.23,45.54 195.42,45.73 | 191.8,37.92 R11.2 | 209.9,38.11 209.71,38.3 R13.2 209.33,38.68 209.33,47.06 203.8,52.59 | 209.9,38.11 210.09,37.92 212.76,37.92 LED6.K | 209.9,38.11 204.37,32.58 204.37,25.35 Q12.S | 195.42,45.73 202.47,52.78 203.61,52.78 203.8,52.59 | 203.8,52.59 218.47,67.26 218.47,68.4 C9.2 218.47,68.78 218.47,83.26 207.42,94.31 U$4.P$2 207.04,94.31 169.89,131.45 | 195.42,45.73 187.61,53.54 168.18,53.54 163.61,48.97 159.42,48.97 159.23,48.78 | 143.99,38.11 142.65,39.44 R5.2 | 143.99,38.11 144.18,37.92 146.46,37.92 LED2.K | 143.99,38.11 138.46,32.58 138.46,25.35 Q4.S
GND@2
  Bottom 0.762: X1.1 115.22,124.03 113.31,125.93 113.31,132.41 C3.2 113.31,132.79 115.22,134.69 115.22,142.69 X2.4 115.6,143.07 119.41,143.07 121.32,141.17 127.79,141.17 U$5.P$4
GND@3  (3 unrouted)
  Bottom 0.762: MOTOR3.2 56.55,12.77 56.55,12.01 55.02,10.49 40.16,10.49 37.5,13.15 MOTOR2.2
INA1
  Bottom 1.016: MOTOR1.6 87.79,138.12 87.79,127.83 78.64,118.69 78.64,98.88 81.31,96.21 82.07,96.21 U$1.P12
INA2  (1 unrouted)
INA3
  Bottom 1.016: MOTOR3.6 47.02,13.15 47.02,14.3 65.31,32.58 82.07,32.58 U$1.P32
INB1
  Bottom 1.016: MOTOR1.5 85.5,138.12 85.5,127.83 77.12,119.45 77.12,97.74 80.93,93.93 82.07,93.93 U$1.P11
INB2  (1 unrouted)
INB3
  Bottom 1.016: MOTOR3.5 49.31,13.15 49.31,13.92 65.31,29.92 82.07,29.92 U$1.P31
M1
  Bottom 1.016: D4.A 118.65,61.16 123.6,61.16 129.7,55.06 200.18,55.06 205.14,60.02 205.14,61.54 171.23,95.45 104.55,95.45 86.26,113.74 85.12,113.74 U$1.P2
M2  (1 unrouted)
M3
  Bottom 1.016: D6.A 153.32,61.92 137.7,61.92 124.75,74.88 120.17,74.88 86.26,108.78 85.12,108.78 U$1.P4
M4
  Bottom 1.016: D7.A 168.94,61.54 155.99,61.54 154.08,59.64 131.98,59.64 93.12,98.5 85.12,98.5 U$1.P8
M5
  Bottom 1.016: D8.A 184.18,61.54 171.61,61.54 168.18,58.11 131.22,58.11 93.5,95.83 85.12,95.83 U$1.P9
M6
  Bottom 1.016: D9.A 202.85,60.78 186.47,60.78 182.28,56.59 130.46,56.59 93.5,93.54 85.12,93.54 U$1.P10
MISO
  Bottom 1.016: SV3.10 146.46,77.54 148.75,77.54 SV3.11 148.75,77.92 148.75,82.5 U$2.P21 148.37,82.88 146.46,82.88 U$2.P19
N$1
  Bottom 1.016: S1.1 252.76,21.92 252.76,16.58 258.86,10.49 X4.1
N$2
  Bottom 1.016: S1.2 252.76,24.96 253.9,24.96 255.43,26.49 255.43,28.77 252.76,31.44 F1.1A
N$3
  Bottom 1.016: R1.1 220,35.25 220,37.92 R2.2 220.38,38.3 220.38,45.92 IC2.1
N$4
  Bottom 1.016: SV3.1 123.6,77.54 123.6,82.5 U$2.P1
N$5
  Bottom 1.016: R1.2 220,24.96 223.42,24.96 C8.2 224.19,24.96 228.76,24.96 230.66,23.06 232.19,23.06 237.52,28.39 237.52,35.25 C1.- 237.9,35.63 240.19,37.92 240.19,48.97 C2.-
N$6
  Bottom 1.016: 231.43,34.11 231.43,24.96 C8.1 | 231.43,34.11 237.52,40.2 C1.+ | IC2.3 226.09,45.92 226.09,39.06 231.04,34.11 231.43,34.11
N$8
  Bottom 1.016: SV3.2 126.27,77.54 126.27,82.5 U$2.P3
N$9
  Bottom 1.016: SV3.3 128.56,77.54 128.56,82.5 U$2.P5
N$10
  Bottom 1.016: SV3.4 131.22,77.54 131.22,82.5 U$2.P7
N$11
  Bottom 1.016: SV3.6 136.18,77.54 136.18,82.5 U$2.P11
N$12
  Bottom 1.016: SV3.7 138.84,77.54 138.84,82.5 U$2.P13
N$13
  Bottom 1.016: SV3.8 141.51,77.54 141.51,82.5 U$2.P15
N$14
  Bottom 1.016: D1.A 252.38,55.83 252.38,52.78 F1.2A
N$17
  Bottom 1.016: SV3.14 156.75,77.54 156.75,82.5 U$2.P27
N$18
  Bottom 1.016: SV3.15 159.03,77.54 159.03,82.5 U$2.P29
N$19
  Bottom 1.016: SV3.16 161.7,77.54 161.7,82.5 U$2.P31
N$20
  Bottom 1.016: SV3.17 164.37,77.54 164.37,82.5 U$2.P33
N$21
  Bottom 1.016: SV3.18 166.66,77.54 166.66,82.5 U$2.P35
N$22
  Bottom 1.016: SV3.19 169.32,77.54 169.32,82.5 U$2.P37
N$23
  Bottom 1.016: SV4.1 123.6,102.69 123.6,98.12 U$2.P2
N$24
  Bottom 1.016: Q1.B 118.27,46.68 118.27,51.25 D4.C
N$26
  Bottom 1.016: SV4.6 136.18,102.69 136.18,98.12 U$2.P12
N$27
  Bottom 1.016: D3.A 147.22,106.12 146.08,106.12 143.79,103.83 143.79,103.07 SV4.9 143.79,102.69 143.79,98.12 U$2.P18
N$28
  Bottom 1.016: Q1.E 115.6,46.3 115.6,39.44 R3.1 115.22,39.06 115.22,34.49 R4.1 115.6,33.73 117.51,31.82 117.51,25.35 Q2.G
N$29
  Bottom 1.016: SV4.11 149.13,102.69 149.13,98.12 U$2.P22
N$30
  Bottom 1.016: R4.2 125.51,34.49 128.17,34.49 128.94,35.25 LED1.A
N$31
  Bottom 1.016: Q3.B 135.03,47.06 135.03,51.63 D5.C
N$32
  Bottom 1.016: SV4.13 154.08,102.69 154.08,98.12 U$2.P26
N$33
  Bottom 1.016: SV4.14 156.75,102.69 156.75,98.12 U$2.P28
N$34
  Bottom 1.016: SV4.16 161.7,102.69 161.7,98.12 U$2.P32
N$35
  Bottom 1.016: SV4.18 166.66,102.69 166.66,98.12 U$2.P36
N$36
  Bottom 1.016: SV4.19 169.32,102.69 169.32,98.12 U$2.P38
N$37
  Bottom 1.016: SV4.20 171.99,102.69 171.99,98.12 U$2.P40
N$38
  Bottom 1.016: D2.A 137.7,107.26 141.13,103.83 141.13,103.07 SV4.8 141.13,102.69 141.13,98.12 U$2.P16
N$39
  Bottom 1.016: Q2.D 120.17,24.96 120.17,18.11 117.89,15.82 117.89,11.63 X3.1
N$40
  Bottom 1.016: U$1.P22 85.12,50.49 85.88,50.49 96.55,61.16 103.41,61.16 SL4.9 104.17,61.16 111.41,61.16 122.46,50.11 122.46,34.49 124.75,32.2 124.75,20.39 120.55,16.2 120.55,10.11 118.65,8.2 117.12,8.2 113.31,12.01 108.74,12.01 X5.1
N$41
  Bottom 1.016: Q3.E 132.37,46.68 132.37,40.2 R5.1 132.37,39.44 132.37,34.49 132.75,34.11 R6.1 133.13,33.35 133.13,25.35 Q4.G
N$42
  Bottom 1.016: R6.2 143.41,34.11 145.32,34.11 146.46,35.25 LED2.A
N$43
  Bottom 1.016: Q4.D 135.79,24.96 135.79,13.53 133.89,11.63 X7.1
N$44
  Bottom 1.016: Q5.B 153.32,46.3 153.32,45.54 154.84,44.02 156.37,44.02 157.51,45.16 157.51,48.21 153.7,52.02 D6.C
N$45
  Bottom 1.016: Q5.E 150.27,46.3 150.27,40.2 149.51,39.44 R7.1 149.51,39.06 149.89,38.68 149.89,34.49 R8.1 149.51,34.11 149.51,25.35 Q6.G
N$46
  Bottom 1.016: R8.2 160.18,34.49 162.08,34.49 162.84,35.25 LED3.A
N$47
  Bottom 1.016: Q6.D 151.8,24.96 151.8,13.53 149.89,11.63 X8.1
N$48
  Bottom 1.016: Q7.B 168.18,47.06 168.18,50.87 168.94,51.63 D7.C
N$49
  Bottom 1.016: Q7.E 165.51,46.68 165.51,39.06 R9.1 165.51,38.68 165.51,34.11 165.89,33.73 R10.1 166.27,33.35 166.27,25.35 Q8.G
N$50
  Bottom 1.016: R10.2 176.18,33.73 176.94,33.73 178.47,35.25 LED4.A
N$51
  Bottom 1.016: Q8.D 168.56,24.96 168.56,13.92 166.27,11.63 X9.1
N$52
  Bottom 1.016: Q9.B 185.32,46.3 185.32,45.54 186.85,44.02 188.37,44.02 189.51,45.16 189.51,48.21 186.09,51.63 184.56,51.63 D8.C
N$53
  Bottom 1.016: Q9.E 182.28,46.3 182.28,39.06 181.51,38.3 R11.1 181.51,37.92 181.89,37.54 181.89,34.49 R12.1 182.28,33.73 182.66,33.35 182.66,25.35 Q10.G
N$54
  Bottom 1.016: R12.2 192.18,34.49 194.47,34.49 195.23,35.25 LED5.A
N$55
  Bottom 1.016: Q10.D 185.32,24.96 185.32,24.2 183.04,21.92 183.04,11.63 X10.1
N$56
  Bottom 1.016: Q11.B 203.23,46.3 203.23,50.49 D9.C
N$57
  Bottom 1.016: Q11.E 200.18,45.92 200.18,39.82 199.42,39.06 R13.1 199.04,38.3 199.04,34.87 R14.1 199.04,34.11 199.04,25.35 Q12.G
N$58
  Bottom 1.016: R14.2 209.33,34.87 212.38,34.87 212.76,35.25 LED6.A
N$59
  Bottom 1.016: Q12.D 201.71,24.96 201.71,13.53 199.8,11.63 X11.1
N$60
  Bottom 1.016: U$1.P23 85.12,48.21 86.26,48.21 96.55,58.49 103.41,58.49 SL4.8 104.17,58.87 112.55,50.49 112.55,34.87 103.79,26.11 103.79,12.39 X5.2
N$61
  Bottom 1.016: U$1.P24 85.12,45.54 86.26,45.54 96.55,55.83 103.41,55.83 SL4.7 104.17,56.21 104.55,56.21 111.03,49.73 111.03,35.63 98.46,23.06 98.46,12.39 X5.3
N$62
  Bottom 1.016: U$1.P25 85.12,42.87 85.88,42.87 96.55,53.54 103.41,53.54 SL4.6 104.17,53.92 109.5,48.59 109.5,36.39 93.5,20.39 93.5,12.39 X5.4
N$63
  Bottom 1.016: U$1.P26 85.12,40.59 86.26,40.59 96.55,50.87 103.41,50.87 SL4.5 104.17,51.25 107.98,47.44 107.98,37.16 88.55,17.73 88.55,12.39 X5.5
N$64
  Bottom 1.016: U$1.P27 85.12,37.92 90.07,37.92 100.36,48.21 103.41,48.21 SL4.4 104.17,48.59 104.55,48.59 106.46,46.68 106.46,37.92 83.6,15.06 83.6,12.39 X5.6
N$65
  Bottom 1.016: 87.03,35.25 85.12,35.25 U$1.P28 | 87.03,35.25 89.69,35.25 100.36,45.92 103.41,45.92 SL4.3 | 87.03,35.25 87.03,28.77 78.64,20.39 78.64,12.39 X5.7
N$66  (2 unrouted)
N$67
  Bottom 1.016: 76.36,8.96 71.79,8.96 68.74,12.01 X5.9 | 76.36,8.96 79.41,8.96 80.55,10.11 80.55,14.3 103.41,37.16 103.41,40.59 SL4.1 | 76.36,8.96 76.36,20.39 84.74,28.77 84.74,29.92 U$1.P30
N$68
  Bottom 1.016: X6.1 14.64,72.97 24.92,62.68 24.92,61.92 SL5.9 25.3,61.16 26.45,61.16 37.11,50.49 39.02,50.49 U$1.P59
N$69
  Bottom 1.016: X6.2 14.64,68.02 23.4,59.25 24.92,59.25 SL5.8 25.3,58.87 26.07,58.87 36.73,48.21 39.02,48.21 U$1.P58
N$70
  Bottom 1.016: X6.3 14.64,63.06 21.11,56.59 24.92,56.59 SL5.7 25.3,56.21 26.45,56.21 37.11,45.54 39.02,45.54 U$1.P57
N$71
  Bottom 1.016: X6.4 14.64,58.11 18.45,54.3 24.92,54.3 SL5.6 25.3,53.54 26.45,53.54 37.11,42.87 39.02,42.87 U$1.P56
N$72
  Bottom 1.016: X6.5 14.64,53.16 16.16,51.63 24.92,51.63 SL5.5 25.3,51.25 26.07,51.25 36.73,40.59 39.02,40.59 U$1.P55
N$73
  Bottom 1.016: X6.6 14.64,48.21 15.02,48.59 24.92,48.59 SL5.4 25.3,48.59 26.45,48.59 37.11,37.92 39.02,37.92 U$1.P54
N$74
  Bottom 1.016: X6.7 14.64,43.25 17.68,46.3 24.92,46.3 SL5.3 25.3,46.3 26.07,46.3 37.11,35.25 39.02,35.25 U$1.P53
N$75
  Bottom 1.016: X6.8 14.64,38.3 19.97,43.63 24.92,43.63 SL5.2 25.3,43.63 26.07,43.63 36.73,32.97 39.02,32.97 U$1.P52
N$76
  Bottom 1.016: X6.9 14.64,33.35 22.26,40.97 24.92,40.97 SL5.1 25.3,40.97 35.97,30.3 39.02,30.3 U$1.P51
N$77
  Bottom 1.016: 23.4,104.97 23.4,106.12 SL6.1 | 23.4,104.97 14.64,96.21 X12.9 | U$1.P71 39.02,93.93 34.83,93.93 23.78,104.97 23.4,104.97
N$78
  Bottom 1.016: X12.8 14.64,101.16 22.26,108.78 23.4,108.78 SL6.2 24.16,109.17 37.11,96.21 39.02,96.21 U$1.P72
N$79
  Bottom 1.016: X12.7 14.64,106.5 19.21,111.07 23.4,111.07 SL6.3 24.16,111.45 24.54,111.45 37.11,98.88 39.02,98.88 U$1.P73
N$80
  Bottom 1.016: X12.6 14.64,111.45 16.92,113.74 23.4,113.74 SL6.4 24.16,113.74 24.92,113.74 37.11,101.55 39.02,101.55 U$1.P74
N$81
  Bottom 1.016: X12.5 14.64,116.41 23.4,116.41 SL6.5 24.16,116.79 37.11,103.83 39.02,103.83 U$1.P75
N$82
  Bottom 1.016: X12.4 14.64,120.98 16.54,119.07 23.4,119.07 SL6.6 24.16,119.07 24.54,119.07 37.11,106.5 39.02,106.5 U$1.P76
N$83
  Bottom 1.016: X12.3 14.64,125.93 18.83,121.74 23.4,121.74 SL6.7 24.16,121.36 24.92,121.36 37.11,109.17 39.02,109.17 U$1.P77
N$84
  Bottom 1.016: X12.2 14.64,130.88 21.11,124.41 23.4,124.41 SL6.8 24.16,124.03 24.54,124.03 37.11,111.45 39.02,111.45 U$1.P78
N$85
  Bottom 1.016: X12.1 14.25,135.84 23.4,126.69 SL6.9 24.16,126.69 24.54,126.69 37.11,114.12 39.02,114.12 U$1.P79
N$86
  Bottom 1.016: ANALOGS.8 44.35,137.36 44.35,112.98 42.83,111.45 42.07,111.45 U$1.P63
N$87
  Bottom 1.016: ANALOGS.7 46.64,137.36 46.64,112.59 43.21,109.17 42.07,109.17 U$1.P64
N$88
  Bottom 1.016: ANALOGS.6 49.31,137.36 49.31,112.98 42.83,106.5 42.07,106.5 U$1.P65
N$89
  Bottom 1.016: ANALOGS.5 51.97,137.36 51.97,112.98 42.83,103.83 42.07,103.83 U$1.P66
N$90
  Bottom 1.016: ANALOGS.4 54.26,137.36 54.26,112.59 43.21,101.55 42.07,101.55 U$1.P67
N$91
  Bottom 1.016: ANALOGS.3 56.93,137.36 56.93,112.98 42.83,98.88 42.07,98.88 U$1.P68
N$92
  Bottom 1.016: ANALOGS.2 59.59,137.36 59.59,112.59 43.21,96.21 42.07,96.21 U$1.P69
N$93
  Bottom 1.016: ANALOGS.1 61.88,137.36 61.88,112.59 43.21,93.93 42.07,93.93 U$1.P70
PWM2
  Bottom 1.016: MOTORLEFT.7 10.44,5.53 8.54,7.44 8.54,71.45 28.35,91.26 42.83,91.26 73.31,121.74 73.31,140.03 76.36,143.07 89.31,143.07 92.74,139.65 92.74,130.5 80.17,117.93 80.17,114.88 80.93,114.12 82.07,114.12 U$1.P19
PWM3  (1 unrouted)
PWM4  (1 unrouted)
PWM5
  Bottom 1.016: MOTOR2.7 25.3,13.53 25.3,14.3 26.83,15.82 34.07,15.82 71.02,52.78 82.07,52.78 U$1.P40
PWM6
  Bottom 1.016: MOTOR3.7 44.35,13.15 44.35,13.92 80.55,50.11 82.07,50.11 U$1.P39
PWM7  (1 unrouted)
RX
  Bottom 1.016: SV4.5 133.89,102.69 133.89,98.12 U$2.P10
TX
  Bottom 1.016: SV4.4 131.22,102.69 131.22,98.12 U$2.P8
VIN
  Bottom 2.032: X3.2 123.22,11.25 129.32,11.25 132.75,7.82 135.41,7.82 138.84,11.25 X7.2 139.6,10.87 143.03,7.44 151.03,7.44 154.84,11.25 X8.2 155.61,10.87 158.65,7.82 167.42,7.82 170.85,11.25 X9.2 171.61,10.87 176.18,6.3 184.56,6.3 187.61,9.34 187.61,10.49 X10.2 187.99,11.25 195.23,11.25 198.66,7.82 201.33,7.82 204.75,11.25 X11.2 204.75,12.39 204.75,21.54 216.19,32.97 216.19,61.54 223.42,68.78 225.33,68.78 226.25,69.09 | D1.C 252,66.11 244.38,66.11 242.09,63.83 IC1.1 241.33,63.45 236.38,68.4 226.47,68.4 C9.1 226.25,69.09 | 190.47,128.02 203.23,140.79 U$3.P$1 | 190.47,128.02 187.99,125.55 U$5.P$1 | 190.47,128.02 207.04,111.45 U$4.P$1 207.42,110.69 226.09,92.02 226.09,69.54 226.25,69.09
(copper drawn outside any net)
  shapes: Top area x2